# EAGLE design firefly (EAGLE 7.3.0)
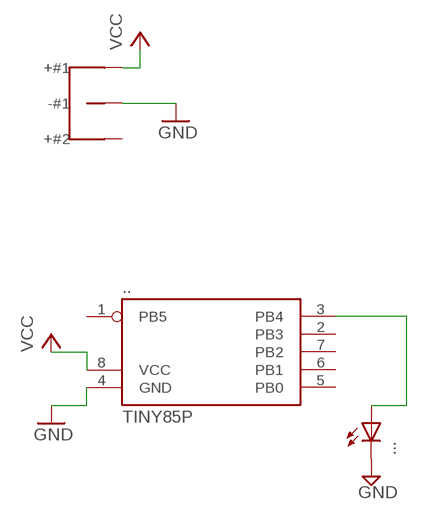
[diagram p0: schematic, sheet 1]

## Parts
.  STRAP-BC-2003  [STRAP-BC-2003]
..  TINY85P  [DIL08]
...  LED5MM  [LED5MM]

## Nets
GND: ..-#1 ..-#2(-#1) ...4(GND) ....K(C)
N$5: ...3(PB4) ....A
VCC: ..+#1 ...8(VCC)
Unconnected: ..+#2 ...1(PB5) ...2(PB3) ...5(PB0) ...6(PB1) ...7(PB2)

## Library data of the parts
. = issackelly:STRAP-BC-2003
.. = gamaral:TINY85: AVR ATtiny85 MICROCONTROLLER 8K ISPF 256 bytes SRAM 512 bytes EEPROM
... = adafruit:LED: LED OSRAM: - CHIPLED LG R971, LG N971, LY N971, LG Q971, LY Q971, LO R971, LY R971 LH N974, LH R974 LS Q976, LO Q976, LY Q976 LO Q996 - Hyper CHIPLED LW Q18S LB Q993, LB Q99A, LB R99A - SideLED LS A670, LO A670, LY A670, LG A670, LP A670 LB A673, LV A673, LT A673, LW A673 LH A674 LY A675 LS A676, LA A676, LO A676, LY A676, LW A676 LS A679, LY A679, LG A679 - Hyper Micro SIDELED® LS Y876, LA Y876, LO Y876, LY Y876 LT Y87S - SmartLED LW L88C, LW L88S LB L89C, LB L89S, LG L890 LS L89K, LO L89K, LY L89K LS L896, LA L896, LO L896, LY L896 - TOPLED LS T670, LO T670, LY T670, LG T670, LP T670 LSG T670, LSP T670, LSY T670, LOP T670, LYG T670 LG T671, LOG T671, LSG T671 LB T673, LV T673, LT T673, LW T673 LH T674 LS T676, LA T676, LO T676, LY T676, LB T676, LH T676, LSB T676, LW T676 LB T67C, LV T67C, LT T67C, LS T67K, LO T67K, LY T67K, LW E67C LS E67B, LA E67B, LO E67B, LY E67B, LB E67C, LV E67C, LT E67C LW T67C LS T679, LY T679, LG T679 LS T770, LO T770, LY T770, LG T770, LP T770 LB T773, LV T773, LT T773, LW T773 LH T774 LS E675, LA E675, LY E675, LS T675 LS T776, LA T776, LO T776, LY T776, LB T776 LHGB T686 LT T68C, LB T68C - Hyper Mini TOPLED® LB M676 - Mini TOPLED Santana® LG M470 LS M47K, LO M47K, LY M47K Source: http://www.osram.convergy.de/

## Board
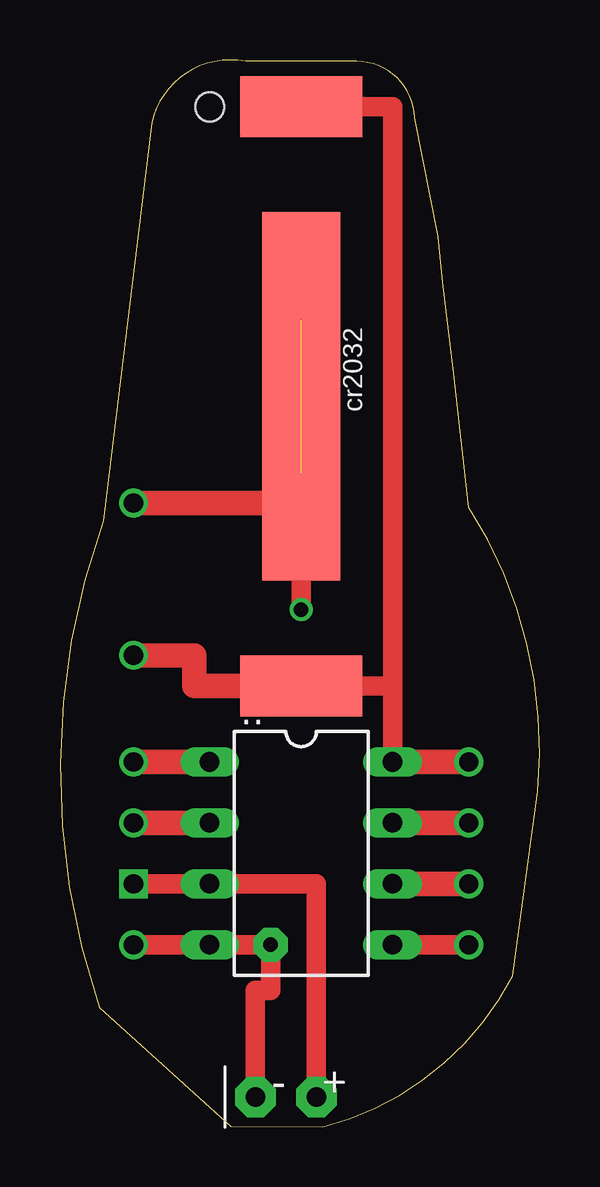
[diagram p1: board, top side]
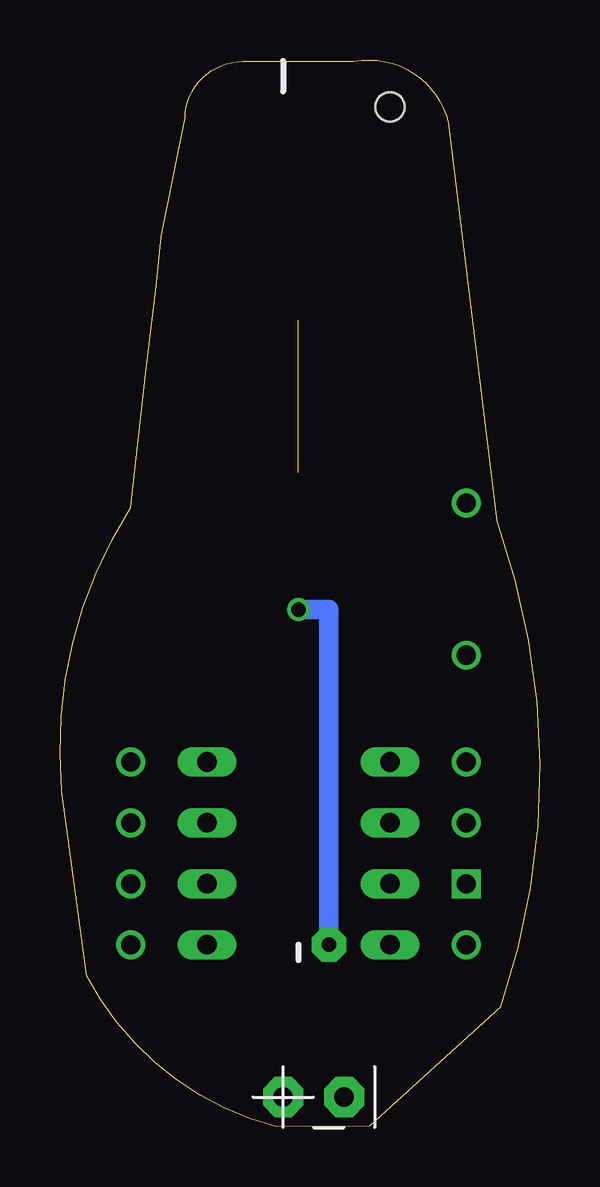
[diagram p2: board, bottom side, seen from below]

Size 19.98 x 44.48 mm. Coordinates in mm from the lower left corner, seen from the top.
Outline: 7.11,0.04 10.95,0 arc48 18.87,6.31 19.7,12.46 arc43 17.03,25.83 16.41,31.42 arc-2 15.76,37.12 14.78,42.08 arc88 12.37,44.42 7.74,44.42 arc88 3.81,41.86 1.79,25.26 arc38 1.64,5 7.11,0.04
Copper layers (1*16): Top 0.0356mm / dielectric 1.5011mm / Bottom 0.0356mm
Design rules "LaenPCBOrder": minimum track width 6mil, minimum drill 13mil, track to track 6mil, track to pad 6mil, pad to pad 6mil, via to via 6mil, smd to smd 6mil, copper to edge 15mil, drill to drill 6mil, minimum pad ring 7mil, minimum via ring 7mil, stop-mask expansion 3mil, vias tented up to drill 0mil, thermal gap 10mil
Holes 1.2 mm at 6.24,42.52

### Footprints (pad centres in the part's own frame; a part is rotated, then mirrored left to right if it is on the bottom)
STRAP-BC-2003 = smd 2.54 x 5.08: +#1 12.7,0; +#2 -11.43,0 | smd 8.992 x 3.251: -#1 -2.54,0; -#2 3.81,0
DIL08 = drill 0.813 long: 1 -3.81,-3.81; 2 -1.27,-3.81; 3 1.27,-3.81; 4 3.81,-3.81; 5 3.81,3.81; 6 1.27,3.81; 7 -1.27,3.81; 8 -3.81,3.81
LED5MM = drill 0.813 pad 1.676 octagon: A -1.27,0; K 1.27,0

### Placement (x,y rotation side)
.  10.05,29.82 90 top
..  10.05,11.41 270 top
...  9.41,1.25 180 top

### Tracks (layer width: path | path; a pad name or v marks a point on that pad's centre or on a via)
GND  (via drill 0.8 pad 1.02)  (4 unrouted)
  Top 0.813: v3.06,7.6 ...4 8.78,7.6 8.78,5.69 8.14,5.69 ....K | ..-#1 10.05,21.57
  Bottom 0.813: 10.05,21.57 8.78,21.57 8.78,7.6
N$5  (via drill 0.8 pad 1.02)
  Top 0.813: v3.06,10.14 ...3 10.68,10.14 ....A
N$13  (via drill 0.8 pad 1.02)
  Top 1.016: v3.06,12.68 6.87,12.68
N$17  (via drill 0.6)
  other vias: 10.05,21.57
N$18  (via drill 0.8 pad 1.02)
  Top 1.016: v3.06,15.22 6.87,15.22
N$19  (via drill 0.8 pad 1.02)
  Top 1.016: 13.22,10.14 v17.03,10.14
N$20  (via drill 0.8 pad 1.02)
  Top 1.016: 13.22,12.68 v17.03,12.68
N$21  (via drill 0.8 pad 1.02)
  Top 1.016: 13.22,15.22 v17.03,15.22
N$22  (via drill 0.8 pad 1.02)
  Top 0.813: v17.03,7.6 13.22,7.6
N$23  (via drill 0.8 pad 1.02)
  Top 1.016: v3.06,19.66 5.6,19.66 5.6,18.39 8.78,18.39
N$25  (via drill 0.8 pad 1.02)
  Top 1.016: v3.06,26.01 8.78,26.01
N$26  (via drill 0.6 pad 1.42)
  other vias: 8.78,7.6
VCC
  Top 0.813: ...8 13.86,18.39 | 10.05,18.39 13.86,18.39 | 13.86,18.39 13.86,42.52 ..+#1